# Altium schematic sheet ltk-mw-display_main.SchDoc: MAIN
size A3; Organization: Altium Limited; Address1: L3, 12a Rodborough Rd; Address2: Frenchs Forest; Address3: NSW; Address4: Australia 2086; DocumentNumber: 1; SheetNumber: 1; SheetTotal: 4
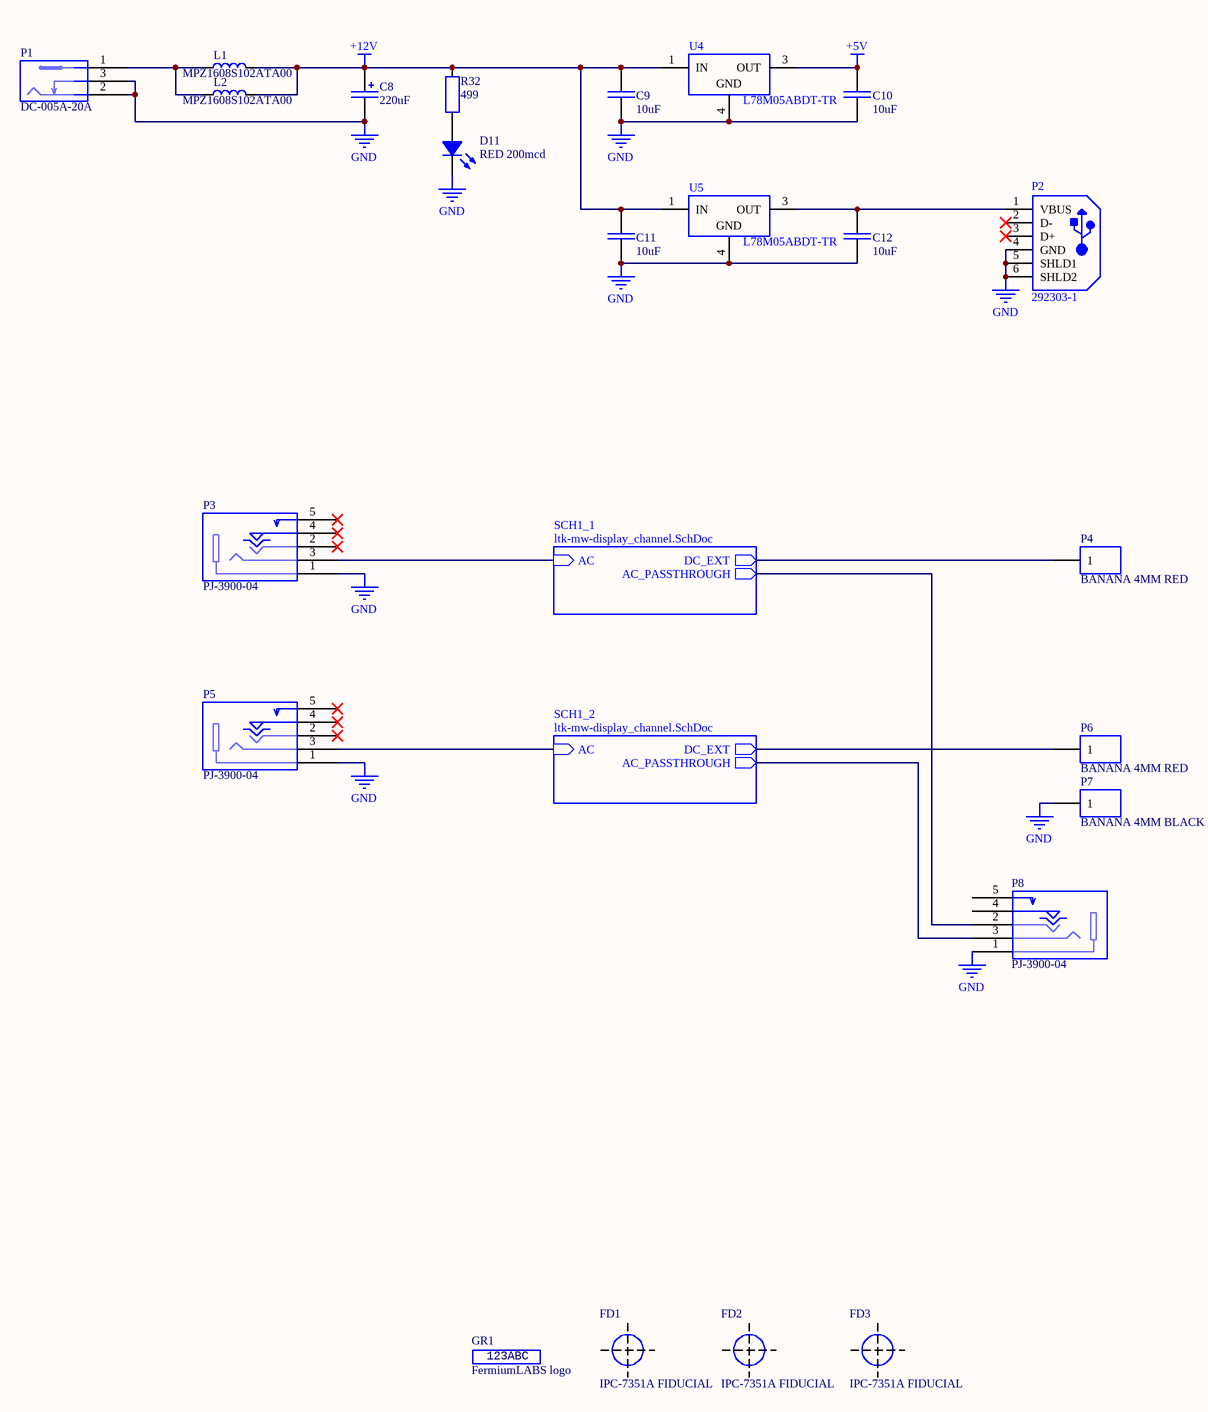
[diagram p0: ltk-mw-display_main.SchDoc]

## Parts
C8  220uF  [3924B366-8672-45E9-B0BE-62DACC24E783]
C9  10uF  [CAP 0805_2012]
C10  10uF  [CAP 0805_2012]
C11  10uF  [CAP 0805_2012]
C12  10uF  [CAP 0805_2012]
D11  RED 200mcd  [ED49B4F6-595F-4D62-96BB-D7184CAA9B94]
FD1  IPC-7351A FIDUCIAL  [FIDUCIAL-IPC-7351A]  (no BOM)
FD2  IPC-7351A FIDUCIAL  [FIDUCIAL-IPC-7351A]  (no BOM)
FD3  IPC-7351A FIDUCIAL  [FIDUCIAL-IPC-7351A]  (no BOM)
GR1  FermiumLABS logo  [5394DE47-A0E8-4329-8464-7791B7C19310]  (no BOM)
L1  MPZ1608S102ATA00  [FER 0603_1608]
L2  MPZ1608S102ATA00  [FER 0603_1608]
P1  DC-005A-20A  [F0972D8A-C5C0-4A84-836D-A9666EE65C2D]
P2  292303-1  [8A51F738-712D-4EE5-9D6B-BB16603F834E]
P3  PJ-3900-04  [7EF2B92C-0FC9-4C85-B662-5CEC65BFCCC4]
P4  BANANA 4MM RED  [2382AA2C-2335-4562-94C7-3B9045982126]
P5  PJ-3900-04  [7EF2B92C-0FC9-4C85-B662-5CEC65BFCCC4]
P6  BANANA 4MM RED  [2382AA2C-2335-4562-94C7-3B9045982126]
P7  BANANA 4MM BLACK  [2382AA2C-2335-4562-94C7-3B9045982126]
P8  PJ-3900-04  [7EF2B92C-0FC9-4C85-B662-5CEC65BFCCC4]
R32  499  [RES 1206_3216]
U4  L78M05ABDT-TR  [4BDA507D-BB70-4009-B963-85AD90086B51]
U5  L78M05ABDT-TR  [4BDA507D-BB70-4009-B963-85AD90086B51]

## Sub-sheets
SCH1_1 = ltk-mw-display_channel.SchDoc: AC (in), DC_EXT (out), AC_PASSTHROUGH (out)
SCH1_2 = ltk-mw-display_channel.SchDoc: AC (in), DC_EXT (out), AC_PASSTHROUGH (out)

## Nets
+5V: C10.1 U4.3(OUT)
+12V: C8.1 C9.1 C11.1 L1.2 L2.2 R32.2 U4.1(IN) U5.1(IN)
GND: C8.2 C9.2 C10.2 C11.2 C12.2 D11.1(K) P1.2 P1.3 P2.4(GND) P2.5(SHLD1) P2.6(SHLD2) P3.1(GND) P5.1(GND) P7.1 P8.1(GND) U4.4(GND) U5.4(GND)
NetC12_1: C12.1 P2.1(VBUS) U5.3(OUT)
NetD11_2: D11.2(A) R32.1
NetL1_1: L1.1 L2.1 P1.1
NetP3_3: P3.3(L) ; sheet SCH1_1/AC
NetP4_1: P4.1 ; sheet SCH1_1/DC_EXT
NetP5_3: P5.3(L) ; sheet SCH1_2/AC
NetP6_1: P6.1 ; sheet SCH1_2/DC_EXT
NetP8_2: P8.2(R) ; sheet SCH1_1/AC_PASSTHROUGH
NetP8_3: P8.3(L) ; sheet SCH1_2/AC_PASSTHROUGH

Not connected (* = marked no-connect by the designer): P2 2(D-)* 3(D+)*; P3 2(R)* 4(AUX)* 5(AUX)*; P5 2(R)* 4(AUX)* 5(AUX)*; P8 4(AUX) 5(AUX)

## Notes on the sheet
- Title
- Fermium LABS srl
- Size:
- Date:
- File:
- A4
- Prj
- Time:
- Sheet
- of
- Via Monselice 15a
- 35142 Padova PD
- Italy
- Git Hash:
- (in symbol 50f8ea88-0034-49fe-a263-d8e97bc35e2f) 123ABC

## Library data of the parts
C8 = 1a28df19-6d3e-4a71-836c-f22920f8e8ab: CAP  THT ELEC 220uF 25V 20%; Manufacturer 1: Rubycon; Manufacturer Part Number 1: 25PK220MEFC-6.3*11; id: 14782; S 1: LCSC; SPN 1: C109337; Part Number: 1a28df19-6d3e-4a71-836c-f22920f8e8ab; ComponentLink1Description: Datasheet; ComponentLink1URL: http://localhost:8080/static/files/Rubycon-220uF-25V_C109337_12019-03-10_214953.757848.pdf?Rubycon-220uF-25V_C109337 (1).pdf; Value: 220uF
C9-C12 = 1ffbe5a9-0884-4740-bdad-20a6a98400e6: CAP SMD MLCC 10uF 25V 0805 X5R; Manufacturer 1: Samsung Electro-Mechanics; Manufacturer Part Number 1: CL21A106KAYNNNE; id: 14779; S 1: LCSC; SPN 1: C84416; SPN 2: C15850; Part Number: 1ffbe5a9-0884-4740-bdad-20a6a98400e6; ComponentLink1Description: Datasheet; ComponentLink1URL: http://localhost:8080/static/files/Samsung-Electro-Mechanics-CL21A106KAYNNNE_C158502019-03-10_213827.610739.pdf?Samsung-Electro-Mechanics-CL21A106KAYNNNE_C15850.pdf; Manufacturer 2: Murata; Manufacturer Part Number 2: GRM21BR61E106KA73L; S 2: LCSC; Value: 10uF
D11 = c65ae3d2-9539-4634-8979-616a331b7494: DIODE LED THT 5MM RED 200mcd; Manufacturer 1: Everlight; Manufacturer Part Number 1: 333-2SURD/S530-A3-L; id: 14851; S 1: LCSC; SPN 1: C99758; Part Number: c65ae3d2-9539-4634-8979-616a331b7494; ComponentLink1Description: Datasheet; ComponentLink1URL: http://localhost:8080/static/files/Everlight-Elec-333-2SURD-S530-A3-L_C997582019-08-18_181624.501044.pdf?Everlight-Elec-333-2SURD-S530-A3-L_C99758.pdf; Value: RED 200mcd
FD1-FD3 = 19da4612-eb95-43bb-9984-553a52b2a224: GRAPHICS FIDUCIAL IPC-7351A; id: 14800; Part Number: 19da4612-eb95-43bb-9984-553a52b2a224
GR1 = 50f8ea88-0034-49fe-a263-d8e97bc35e2f: GRAPHICS LOGO FERMIUM LABS SRL; id: 14799; Part Number: 50f8ea88-0034-49fe-a263-d8e97bc35e2f
L1 L2 = a4b2e015-bf25-47b8-954c-a5b040744a3a: FER SMD CHIP 0603 800mA 1K@100MHz 300mOhm; Manufacturer 1: TDK; id: 14850; S 1: LCSC; SPN 1: C76814; Part Number: a4b2e015-bf25-47b8-954c-a5b040744a3a; ComponentLink1Description: Datasheet; ComponentLink1URL: http://localhost:8080/static/files/TDK-MPZ1608S102ATA00_C768142019-08-18_021255.210641.pdf?TDK-MPZ1608S102ATA00_C76814.pdf; Manufacturer Part Number 1: MPZ1608S102ATA00
P1 = b53db51a-1725-412b-9039-fa7a45c7c438: CONN THT DC JACK 0.5A 30VDC 5Kcycles; Manufacturer 1: HRO Electronics; id: 14780; S 1: LCSC; SPN 1: C191049; Part Number: b53db51a-1725-412b-9039-fa7a45c7c438; ComponentLink1Description: Datasheet; ComponentLink1URL: http://localhost:8080/static/files/Korean-Hroparts-Elec-DC-005A-20A_C191049_22019-03-10_214231.486078.pdf?Korean-Hroparts-Elec-DC-005A-20A_C191049 (2).pdf; Manufacturer Part Number 1: DC-005A-20A
P2 = 9ff2a560-e541-4da0-adda-013cc9c65511: CONN THT USB TYPE-A HIGH RELIABILITY; Manufacturer 1: TE Connectivity; id: 14855; S 1: LCSC; SPN 1: C86461; Part Number: 9ff2a560-e541-4da0-adda-013cc9c65511; ComponentLink1Description: Datasheet; ComponentLink1URL: http://localhost:8080/static/files/TE_Connectivity-292303-1-datasheet2019-08-25_172711.777436.pdf?TE_Connectivity-292303-1-datasheet.pdf; Manufacturer Part Number 1: 292303-1
P3 P5 P8 = 80507a24-5d7c-4cf5-953e-f54832d54564: CONN THT 3.5mm AUDIO STEREO AUX SWITCH; Manufacturer 1: HRO Electronics; id: 14793; S 1: LCSC; SPN 1: C151839; Part Number: 80507a24-5d7c-4cf5-953e-f54832d54564; ComponentLink1Description: Datasheet; ComponentLink1URL: http://localhost:8080/static/files/Korean-Hroparts-Elec-PJ-3900-04_C1518392019-04-10_231144.687617.pdf?Korean-Hroparts-Elec-PJ-3900-04_C151839.pdf; Manufacturer Part Number 1: PJ-3900-04
P4 P6 = 3b84d3c9-1de5-4004-b768-3958a778153b: CONN BANANA SOCKET 4MM RED; Manufacturer 1: Changzhou Amass Elec; Manufacturer Part Number 1: 24.247.1; id: 14826; S 1: LCSC; SPN 1: C106273; Part Number: 3b84d3c9-1de5-4004-b768-3958a778153b; ComponentLink1Description: Datasheet; ComponentLink1URL: http://localhost:8080/static/files/Changzhou-Amass-Elec-24-247-1_C1062732019-08-09_175257.693472.pdf?Changzhou-Amass-Elec-24-247-1_C106273.pdf
P7 = 80ef162c-aaff-440a-80ad-5900ce15f9c1: CONN BANANA SOCKET 4MM BLACK; Manufacturer 1: Changzhou Amass Elec; Manufacturer Part Number 1: 24.247.2; id: 14827; S 1: LCSC; SPN 1: C106272; Part Number: 80ef162c-aaff-440a-80ad-5900ce15f9c1
R32 = c8bf8de8-3430-48dd-94ac-a027709c0c4f: RES SMD 499 OHM 1% 1/4W 1206; Manufacturer 1: Yageo; Manufacturer Part Number 1: RC1206FR-07499RL; id: 14010; S 1: LCSC; SPN 1: C137267; Part Number: c8bf8de8-3430-48dd-94ac-a027709c0c4f; Value: 499
U4 U5 = 446536aa-1bdd-4764-8cae-49f4e0c126ff: IC SMD LINEAR VOLTAGE REGULATOR 5V 500mA DPAK/TO-252; Manufacturer 1: ST Microelectronics; id: 14848; S 1: LCSC; SPN 1: C58069; Part Number: 446536aa-1bdd-4764-8cae-49f4e0c126ff; ComponentLink1Description: Datasheet; ComponentLink1URL: http://localhost:8080/static/files/STMicroelectronics-L78M05ABDT-TR_C580692019-08-17_184424.026041.pdf?STMicroelectronics-L78M05ABDT-TR_C58069.pdf; Manufacturer Part Number 1: L78M05ABDT-TR